# Altium schematic sheet Public_CPU_Power.SchDoc
size D
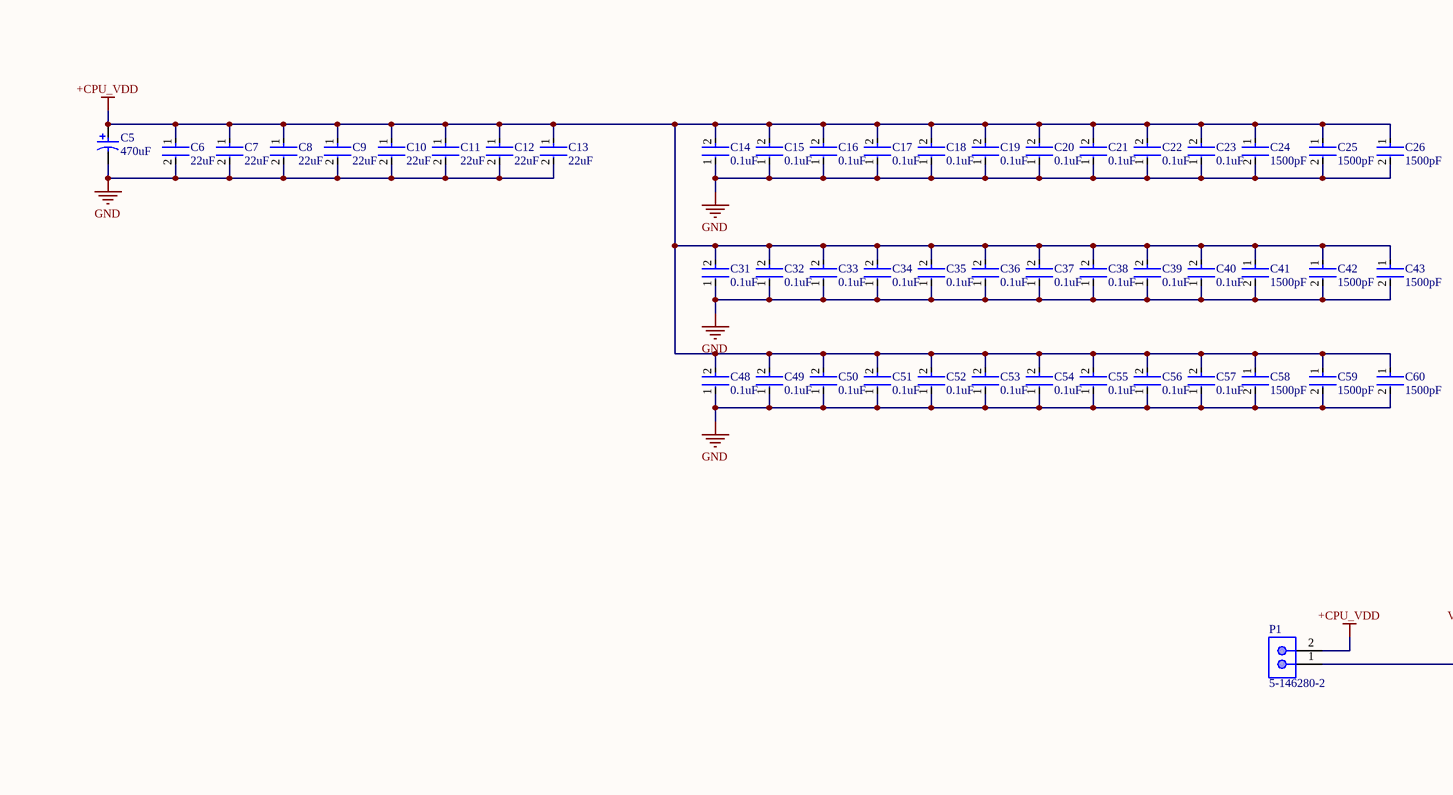
[diagram p0: Public_CPU_Power.SchDoc, top left]
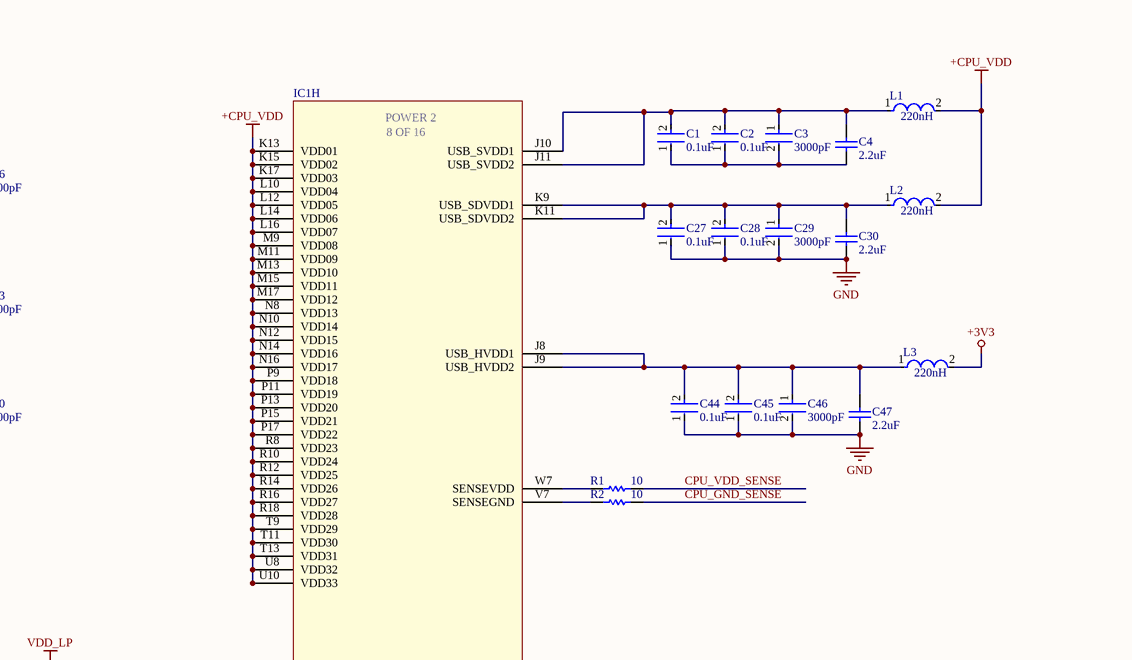
[diagram p1: Public_CPU_Power.SchDoc, top right]
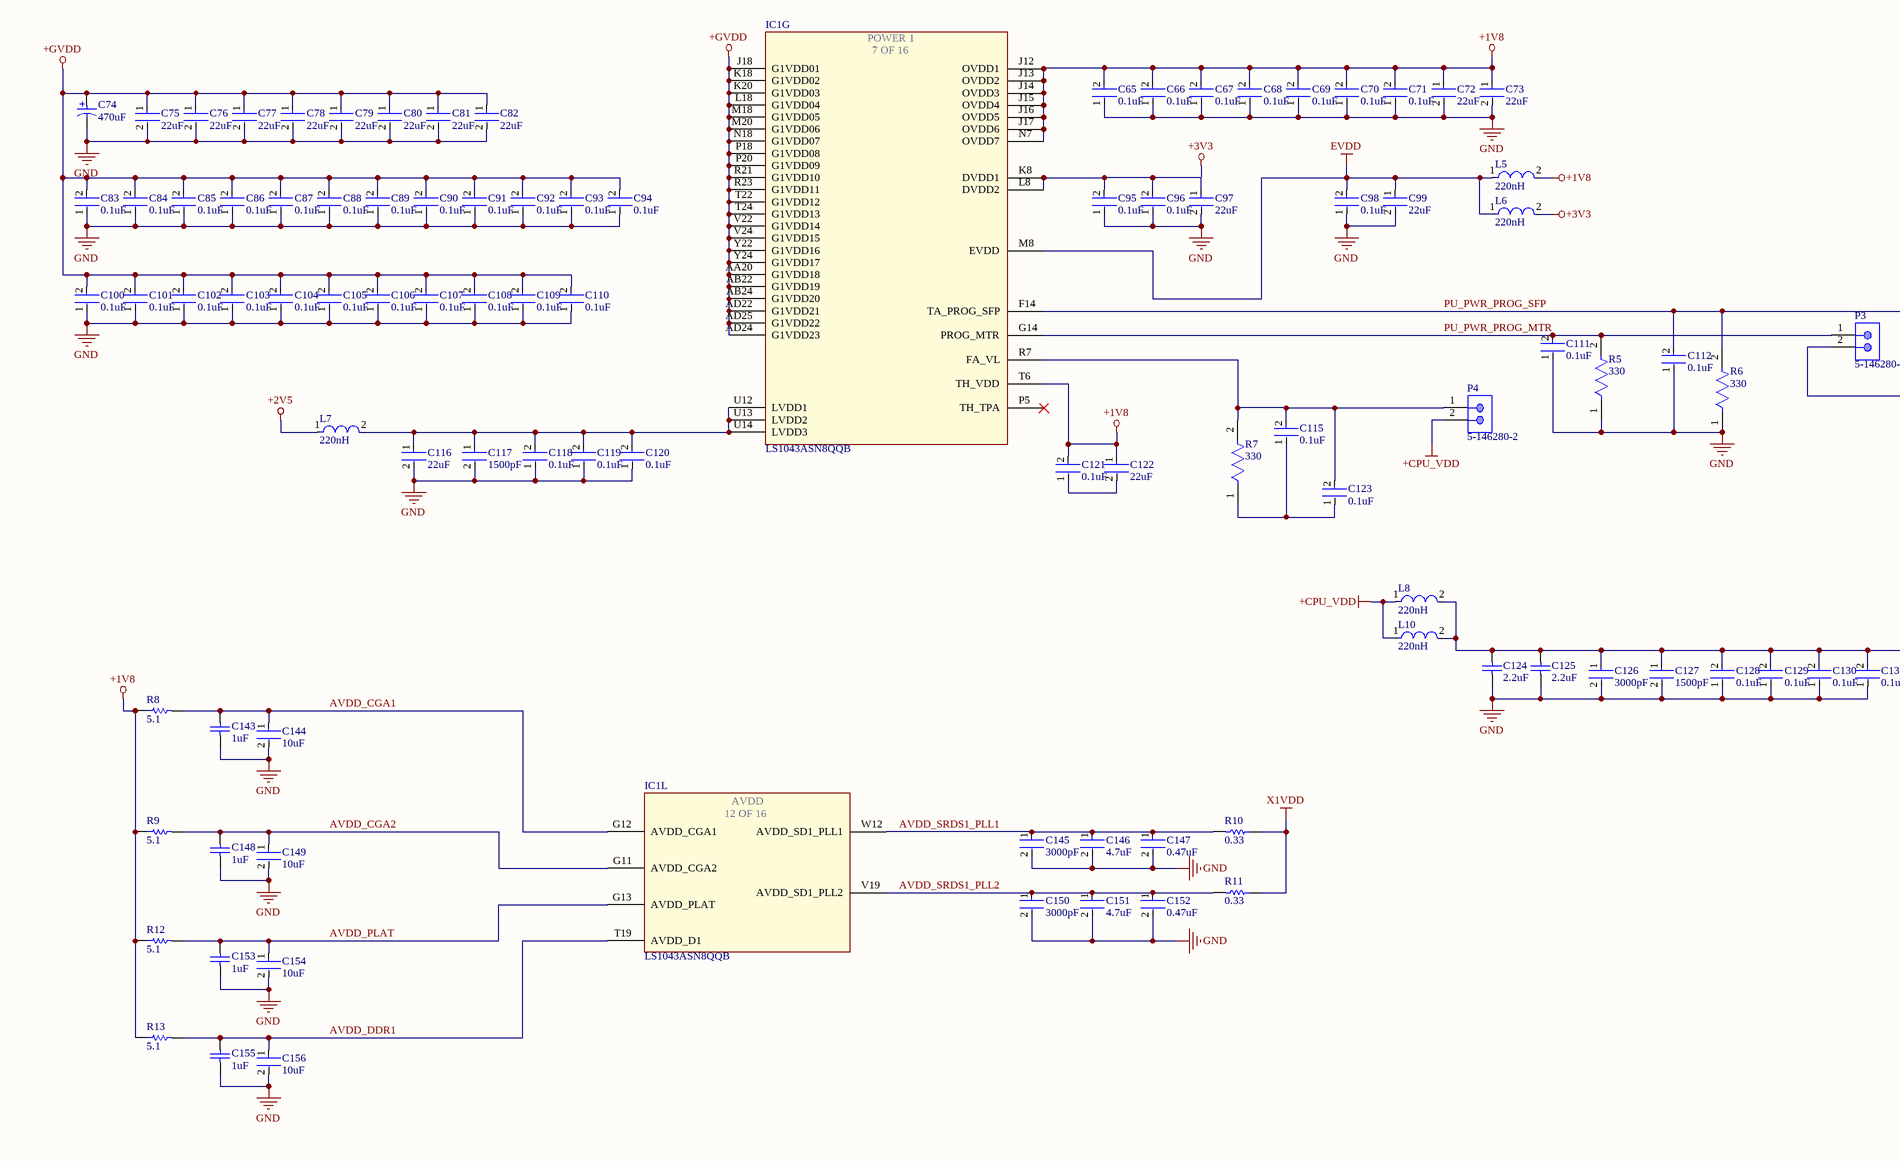
[diagram p2: Public_CPU_Power.SchDoc, bottom left]
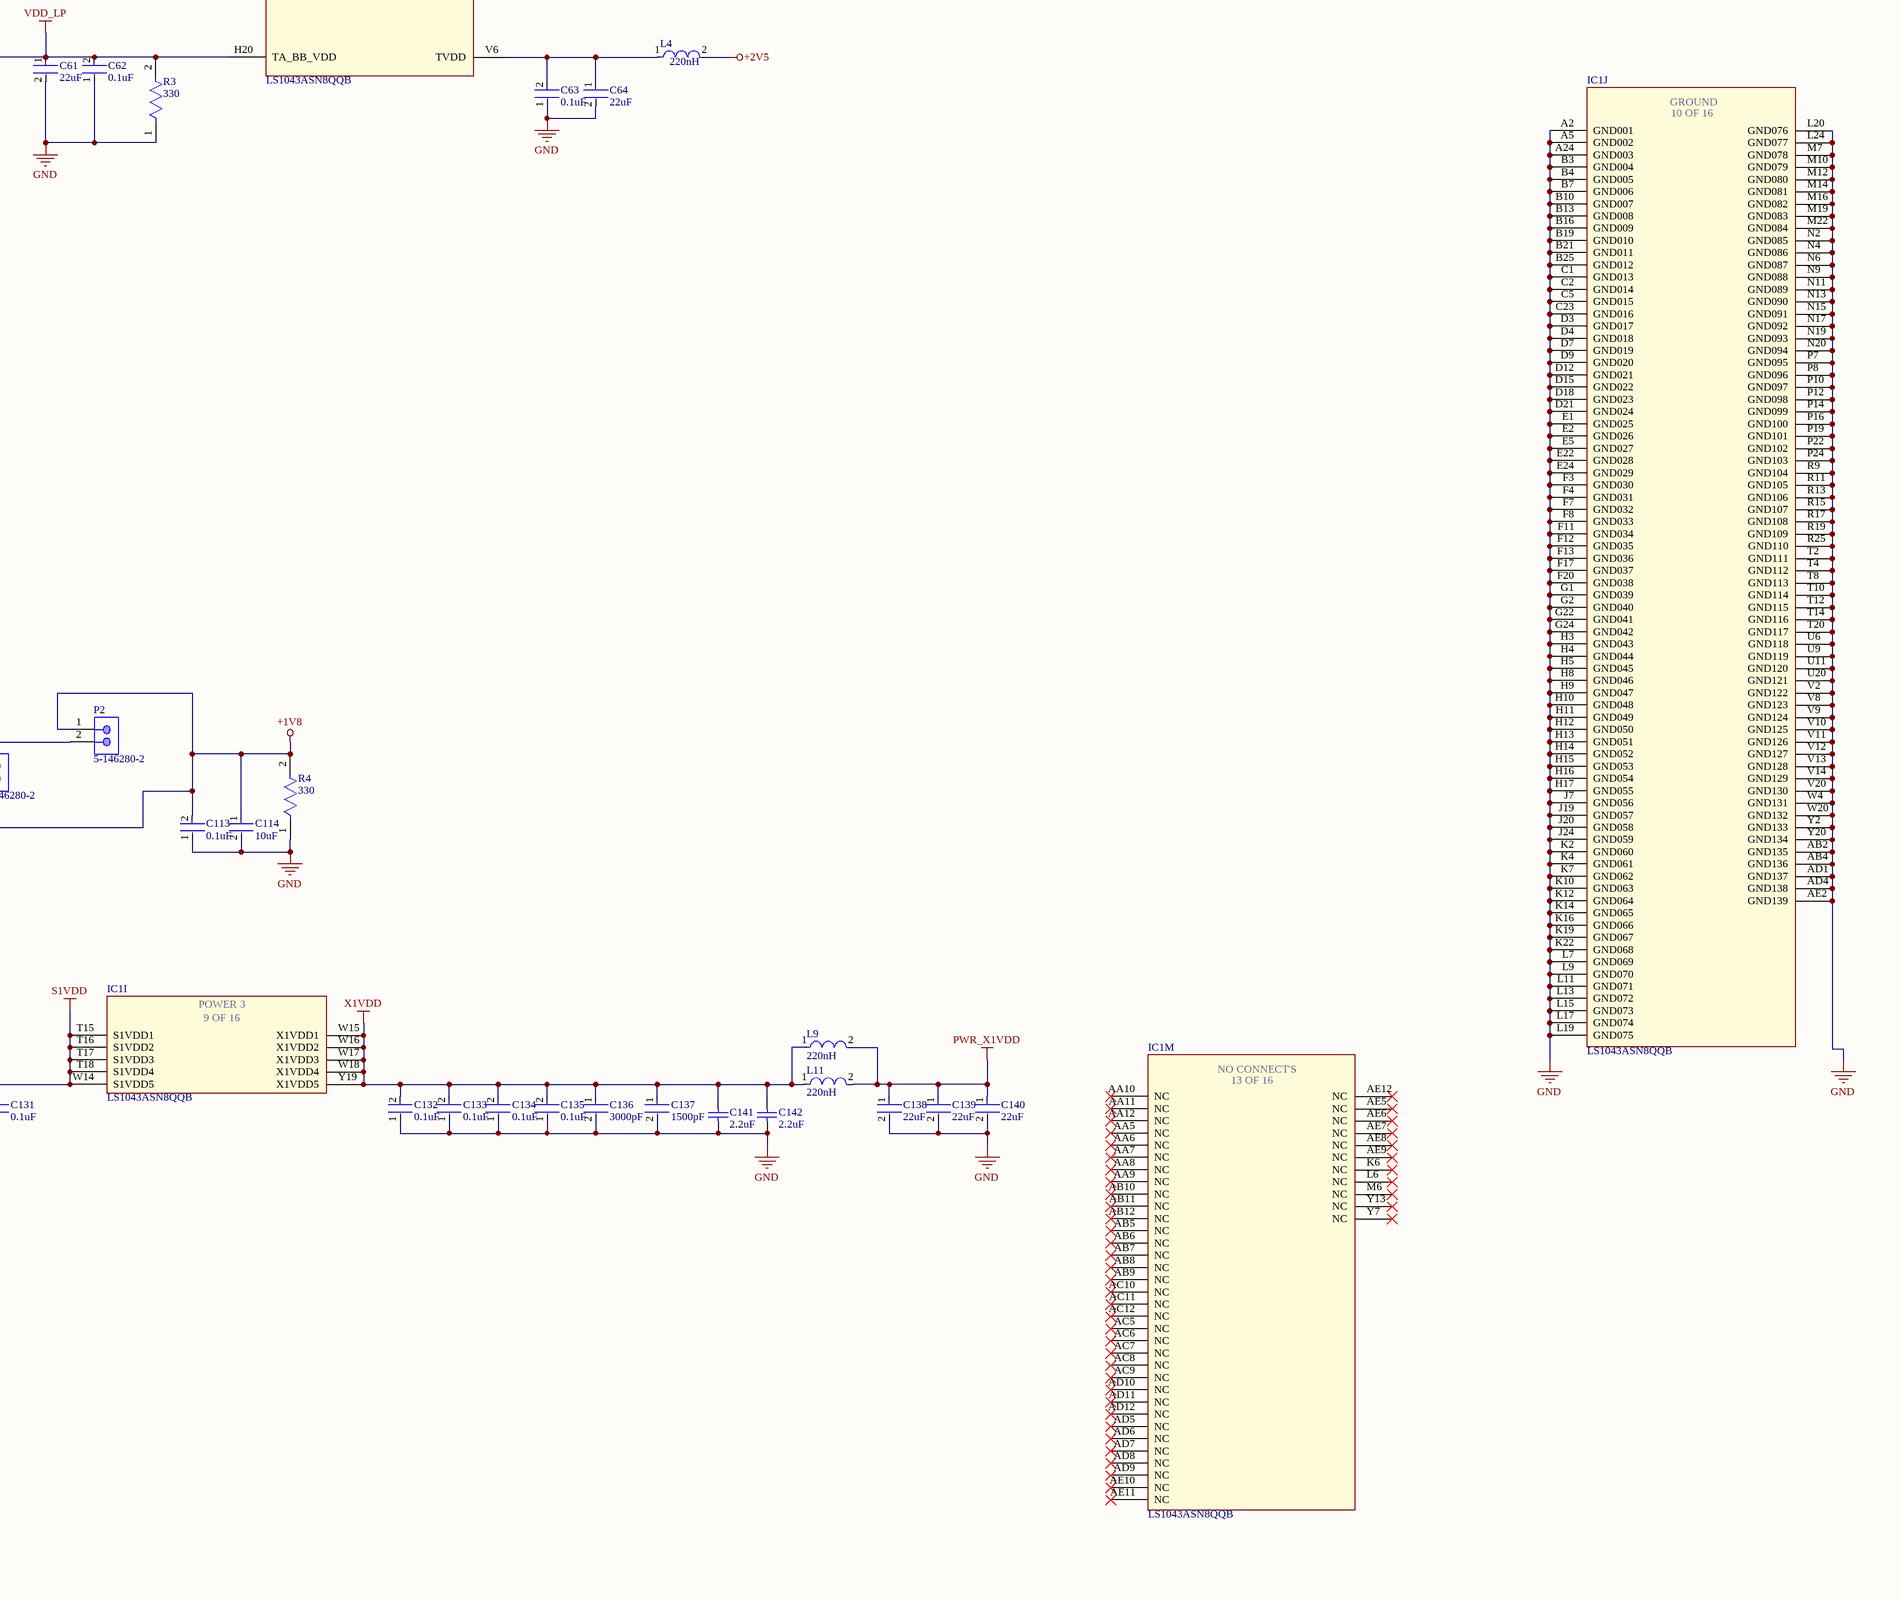
[diagram p3: Public_CPU_Power.SchDoc, bottom right]

## Parts
C1  0.1uF  [FP-GRM15-MFG]
C2  0.1uF  [FP-GRM15-MFG]
C3  3000pF  [FP-GRM155-0_05-IPC_B]
C4  2.2uF  [CAPC1005X55X30NL05T10]
C5  470uF  [PNSC-FK-V-F_V]
C6  22uF  [FP-GRM21B-0_15-MFG]
C7  22uF  [FP-GRM21B-0_15-MFG]
C8  22uF  [FP-GRM21B-0_15-MFG]
C9  22uF  [FP-GRM21B-0_15-MFG]
C10  22uF  [FP-GRM21B-0_15-MFG]
C11  22uF  [FP-GRM21B-0_15-MFG]
C12  22uF  [FP-GRM21B-0_15-MFG]
C13  22uF  [FP-GRM21B-0_15-MFG]
C14  0.1uF  [FP-GRM15-MFG]
C15  0.1uF  [FP-GRM15-MFG]
C16  0.1uF  [FP-GRM15-MFG]
C17  0.1uF  [FP-GRM15-MFG]
C18  0.1uF  [FP-GRM15-MFG]
C19  0.1uF  [FP-GRM15-MFG]
C20  0.1uF  [FP-GRM15-MFG]
C21  0.1uF  [FP-GRM15-MFG]
C22  0.1uF  [FP-GRM15-MFG]
C23  0.1uF  [FP-GRM15-MFG]
C24  1500pF  [FP-C0402-BB-MFG]
C25  1500pF  [FP-C0402-BB-MFG]
C26  1500pF  [FP-C0402-BB-MFG]
C27  0.1uF  [FP-GRM15-MFG]
C28  0.1uF  [FP-GRM15-MFG]
C29  3000pF  [FP-GRM155-0_05-IPC_B]
C30  2.2uF  [CAPC1005X55X30NL05T10]
C31  0.1uF  [FP-GRM15-MFG]
C32  0.1uF  [FP-GRM15-MFG]
C33  0.1uF  [FP-GRM15-MFG]
C34  0.1uF  [FP-GRM15-MFG]
C35  0.1uF  [FP-GRM15-MFG]
C36  0.1uF  [FP-GRM15-MFG]
C37  0.1uF  [FP-GRM15-MFG]
C38  0.1uF  [FP-GRM15-MFG]
C39  0.1uF  [FP-GRM15-MFG]
C40  0.1uF  [FP-GRM15-MFG]
C41  1500pF  [FP-C0402-BB-MFG]
C42  1500pF  [FP-C0402-BB-MFG]
C43  1500pF  [FP-C0402-BB-MFG]
C44  0.1uF  [FP-GRM15-MFG]
C45  0.1uF  [FP-GRM15-MFG]
C46  3000pF  [FP-GRM155-0_05-IPC_B]
C47  2.2uF  [CAPC1005X55X30NL05T10]
C48  0.1uF  [FP-GRM15-MFG]
C49  0.1uF  [FP-GRM15-MFG]
C50  0.1uF  [FP-GRM15-MFG]
C51  0.1uF  [FP-GRM15-MFG]
C52  0.1uF  [FP-GRM15-MFG]
C53  0.1uF  [FP-GRM15-MFG]
C54  0.1uF  [FP-GRM15-MFG]
C55  0.1uF  [FP-GRM15-MFG]
C56  0.1uF  [FP-GRM15-MFG]
C57  0.1uF  [FP-GRM15-MFG]
C58  1500pF  [FP-C0402-BB-MFG]
C59  1500pF  [FP-C0402-BB-MFG]
C60  1500pF  [FP-C0402-BB-MFG]
C61  22uF  [FP-GRM21B-0_15-MFG]
C62  0.1uF  [FP-GRM15-MFG]
C63  0.1uF  [FP-GRM15-MFG]
C64  22uF  [FP-GRM21B-0_15-MFG]
C65  0.1uF  [FP-GRM15-MFG]
C66  0.1uF  [FP-GRM15-MFG]
C67  0.1uF  [FP-GRM15-MFG]
C68  0.1uF  [FP-GRM15-MFG]
C69  0.1uF  [FP-GRM15-MFG]
C70  0.1uF  [FP-GRM15-MFG]
C71  0.1uF  [FP-GRM15-MFG]
C72  22uF  [FP-GRM21B-0_15-MFG]
C73  22uF  [FP-GRM21B-0_15-MFG]
C74  470uF  [PNSC-FK-V-F_V]
C75  22uF  [FP-GRM21B-0_15-MFG]
C76  22uF  [FP-GRM21B-0_15-MFG]
C77  22uF  [FP-GRM21B-0_15-MFG]
C78  22uF  [FP-GRM21B-0_15-MFG]
C79  22uF  [FP-GRM21B-0_15-MFG]
C80  22uF  [FP-GRM21B-0_15-MFG]
C81  22uF  [FP-GRM21B-0_15-MFG]
C82  22uF  [FP-GRM21B-0_15-MFG]
C83  0.1uF  [FP-GRM15-MFG]
C84  0.1uF  [FP-GRM15-MFG]
C85  0.1uF  [FP-GRM15-MFG]
C86  0.1uF  [FP-GRM15-MFG]
C87  0.1uF  [FP-GRM15-MFG]
C88  0.1uF  [FP-GRM15-MFG]
C89  0.1uF  [FP-GRM15-MFG]
C90  0.1uF  [FP-GRM15-MFG]
C91  0.1uF  [FP-GRM15-MFG]
C92  0.1uF  [FP-GRM15-MFG]
C93  0.1uF  [FP-GRM15-MFG]
C94  0.1uF  [FP-GRM15-MFG]
C95  0.1uF  [FP-GRM15-MFG]
C96  0.1uF  [FP-GRM15-MFG]
C97  22uF  [FP-GRM21B-0_15-MFG]
C98  0.1uF  [FP-GRM15-MFG]
C99  22uF  [FP-GRM21B-0_15-MFG]
C100  0.1uF  [FP-GRM15-MFG]
C101  0.1uF  [FP-GRM15-MFG]
C102  0.1uF  [FP-GRM15-MFG]
C103  0.1uF  [FP-GRM15-MFG]
C104  0.1uF  [FP-GRM15-MFG]
C105  0.1uF  [FP-GRM15-MFG]
C106  0.1uF  [FP-GRM15-MFG]
C107  0.1uF  [FP-GRM15-MFG]
C108  0.1uF  [FP-GRM15-MFG]
C109  0.1uF  [FP-GRM15-MFG]
C110  0.1uF  [FP-GRM15-MFG]
C111  0.1uF  [FP-GRM15-MFG]
C112  0.1uF  [FP-GRM15-MFG]
C113  0.1uF  [FP-GRM15-MFG]
C114  10uF  [FP-C0805C-DG-MFG]
C115  0.1uF  [FP-GRM15-MFG]
C116  22uF  [FP-GRM21B-0_15-MFG]
C117  1500pF  [FP-C0402-BB-MFG]
C118  0.1uF  [FP-GRM15-MFG]
C119  0.1uF  [FP-GRM15-MFG]
C120  0.1uF  [FP-GRM15-MFG]
C121  0.1uF  [FP-GRM15-MFG]
C122  22uF  [FP-GRM21B-0_15-MFG]
C123  0.1uF  [FP-GRM15-MFG]
C124  2.2uF  [CAPC1005X55X30NL05T10]
C125  2.2uF  [CAPC1005X55X30NL05T10]
C126  3000pF  [FP-GRM155-0_05-IPC_B]
C127  1500pF  [FP-C0402-BB-MFG]
C128  0.1uF  [FP-GRM15-MFG]
C129  0.1uF  [FP-GRM15-MFG]
C130  0.1uF  [FP-GRM15-MFG]
C131  0.1uF  [FP-GRM15-MFG]
C132  0.1uF  [FP-GRM15-MFG]
C133  0.1uF  [FP-GRM15-MFG]
C134  0.1uF  [FP-GRM15-MFG]
C135  0.1uF  [FP-GRM15-MFG]
C136  3000pF  [FP-GRM155-0_05-IPC_B]
C137  1500pF  [FP-C0402-BB-MFG]
C138  22uF  [FP-GRM21B-0_15-MFG]
C139  22uF  [FP-GRM21B-0_15-MFG]
C140  22uF  [FP-GRM21B-0_15-MFG]
C141  2.2uF  [CAPC1005X55X30NL05T10]
C142  2.2uF  [CAPC1005X55X30NL05T10]
C143  1uF  [CAPC1005X60X30LL05T10]
C144  10uF  [FP-C0805C-DG-MFG]
C145  3000pF  [FP-GRM155-0_05-IPC_B]
C146  4.7uF  [FP-GRM188-0_2-IPC_C]
C147  0.47uF  [FP-GRM188-0_1-e0_2_0_5-IPC_B]
C148  1uF  [CAPC1005X60X30LL05T10]
C149  10uF  [FP-C0805C-DG-MFG]
C150  3000pF  [FP-GRM155-0_05-IPC_B]
C151  4.7uF  [FP-GRM188-0_2-IPC_C]
C152  0.47uF  [FP-GRM188-0_1-e0_2_0_5-IPC_B]
C153  1uF  [CAPC1005X60X30LL05T10]
C154  10uF  [FP-C0805C-DG-MFG]
C155  1uF  [CAPC1005X60X30LL05T10]
C156  10uF  [FP-C0805C-DG-MFG]
IC1  LS1043ASN8QQB  [BGA780C80P28X28_2300X2300X261]  (parts G,H,I,J,L,M of 16)
L1  220nH  [FP-MPLCG0530-MFG]
L2  220nH  [FP-MPLCG0530-MFG]
L3  220nH  [FP-MPLCG0530-MFG]
L4  220nH  [FP-MPLCG0530-MFG]
L5  220nH  [FP-MPLCG0530-MFG]
L6  220nH  [FP-MPLCG0530-MFG]
L7  220nH  [FP-MPLCG0530-MFG]
L8  220nH  [FP-MPLCG0530-MFG]
L9  220nH  [FP-MPLCG0530-MFG]
L10  220nH  [FP-MPLCG0530-MFG]
L11  220nH  [FP-MPLCG0530-MFG]
P1  5-146280-2  [TECO-5-146280-2_V]
P2  5-146280-2  [TECO-5-146280-2_V]
P3  5-146280-2  [TECO-5-146280-2_V]
P4  5-146280-2  [TECO-5-146280-2_V]
R1  10  [RESC1005X40X25NL05T05]
R2  10  [RESC1005X40X25NL05T05]
R3  330  [FP-CRCW0402-e3-IPC_B]
R4  330  [FP-CRCW0402-e3-MFG]
R5  330  [FP-CRCW0402-e3-MFG]
R6  330  [FP-CRCW0402-e3-MFG]
R7  330  [FP-CRCW0402-e3-MFG]
R8  5.1  [RESC1005X40X25LL05T05]
R9  5.1  [RESC1005X40X25LL05T05]
R10  0.33  [RESC2013X50X40LL20T20]
R11  0.33  [RESC2013X50X40LL20T20]
R12  5.1  [RESC1005X40X25LL05T05]
R13  5.1  [RESC1005X40X25LL05T05]

## Nets
+1V8: C65.2 C66.2 C67.2 C68.2 C69.2 C70.2 C71.2 C72.1 C73.1 C113.2 C114.1 C121.2 C122.1 IC1.J12(OVDD1) IC1.J13(OVDD2) IC1.J14(OVDD3) IC1.J15(OVDD4) IC1.J16(OVDD5) IC1.J17(OVDD6) IC1.N7(OVDD7) IC1.T6(TH_VDD) L5.2 P2.1 P3.2 R4.2 R8.1 R9.1 R12.1 R13.1
+2V5: L4.2 L7.1
+3V3: L3.2 L6.2
+CPU_VDD: C5.1 C6.1 C7.1 C8.1 C9.1 C10.1 C11.1 C12.1 C13.1 C14.2 C15.2 C16.2 C17.2 C18.2 C19.2 C20.2 C21.2 C22.2 C23.2 C24.1 C25.1 C26.1 C31.2 C32.2 C33.2 C34.2 C35.2 C36.2 C37.2 C38.2 C39.2 C40.2 C41.1 C42.1 C43.1 C48.2 C49.2 C50.2 C51.2 C52.2 C53.2 C54.2 C55.2 C56.2 C57.2 C58.1 C59.1 C60.1 IC1.K13(VDD01) IC1.K15(VDD02) IC1.K17(VDD03) IC1.L10(VDD04) IC1.L12(VDD05) IC1.L14(VDD06) IC1.L16(VDD07) IC1.M9(VDD08) IC1.M11(VDD09) IC1.M13(VDD10) IC1.M15(VDD11) IC1.M17(VDD12) IC1.N8(VDD13) IC1.N10(VDD14) IC1.N12(VDD15) IC1.N14(VDD16) IC1.N16(VDD17) IC1.P9(VDD18) IC1.P11(VDD19) IC1.P13(VDD20) IC1.P15(VDD21) IC1.P17(VDD22) IC1.R8(VDD23) IC1.R10(VDD24) IC1.R12(VDD25) IC1.R14(VDD26) IC1.R16(VDD27) IC1.R18(VDD28) IC1.T9(VDD29) IC1.T11(VDD30) IC1.T13(VDD31) IC1.U8(VDD32) IC1.U10(VDD33) L1.2 L2.2 L8.1 L10.1 P1.2 P4.2
+GVDD: C74.1 C75.1 C76.1 C77.1 C78.1 C79.1 C80.1 C81.1 C82.1 C83.2 C84.2 C85.2 C86.2 C87.2 C88.2 C89.2 C90.2 C91.2 C92.2 C93.2 C94.2 C100.2 C101.2 C102.2 C103.2 C104.2 C105.2 C106.2 C107.2 C108.2 C109.2 C110.2 IC1.AA20(G1VDD18) IC1.AB22(G1VDD19) IC1.AB24(G1VDD20) IC1.AD22(G1VDD21) IC1.AD24(G1VDD23) IC1.AD25(G1VDD22) IC1.J18(G1VDD01) IC1.K18(G1VDD02) IC1.K20(G1VDD03) IC1.L18(G1VDD04) IC1.M18(G1VDD05) IC1.M20(G1VDD06) IC1.N18(G1VDD07) IC1.P18(G1VDD08) IC1.P20(G1VDD09) IC1.R21(G1VDD10) IC1.R23(G1VDD11) IC1.T22(G1VDD12) IC1.T24(G1VDD13) IC1.V22(G1VDD14) IC1.V24(G1VDD15) IC1.Y22(G1VDD16) IC1.Y24(G1VDD17)
EVDD: C98.2 C99.1 IC1.M8(EVDD) L5.1 L6.1
GND: C5.2 C6.2 C7.2 C8.2 C9.2 C10.2 C11.2 C12.2 C13.2 C14.1 C15.1 C16.1 C17.1 C18.1 C19.1 C20.1 C21.1 C22.1 C23.1 C24.2 C25.2 C26.2 C27.1 C28.1 C29.2 C30.1 C31.1 C32.1 C33.1 C34.1 C35.1 C36.1 C37.1 C38.1 C39.1 C40.1 C41.2 C42.2 C43.2 C44.1 C45.1 C46.2 C47.1 C48.1 C49.1 C50.1 C51.1 C52.1 C53.1 C54.1 C55.1 C56.1 C57.1 C58.2 C59.2 C60.2 C61.2 C62.1 C63.1 C64.2 C65.1 C66.1 C67.1 C68.1 C69.1 C70.1 C71.1 C72.2 C73.2 C74.2 C75.2 C76.2 C77.2 C78.2 C79.2 C80.2 C81.2 C82.2 C83.1 C84.1 C85.1 C86.1 C87.1 C88.1 C89.1 C90.1 C91.1 C92.1 C93.1 C94.1 C95.1 C96.1 C97.2 C98.1 C99.2 C100.1 C101.1 C102.1 C103.1 C104.1 C105.1 C106.1 C107.1 C108.1 C109.1 C110.1 C111.1 C112.1 C113.1 C114.2 C116.2 C117.2 C118.1 C119.1 C120.1 C124.1 C125.1 C126.2 C127.2 C128.1 C129.1 C130.1 C131.1 C132.1 C133.1 C134.1 C135.1 C136.2 C137.2 C138.2 C139.2 C140.2 C141.1 C142.1 C143.1 C144.2 C145.2 C146.2 C147.2 C148.1 C149.2 C150.2 C151.2 C152.2 C153.1 C154.2 C155.1 C156.2 IC1.A2(GND001) IC1.A5(GND002) IC1.A24(GND003) IC1.AB2(GND135) IC1.AB4(GND136) IC1.AD1(GND137) IC1.AD4(GND138) IC1.AE2(GND139) IC1.B3(GND004) IC1.B4(GND005) IC1.B7(GND006) IC1.B10(GND007) IC1.B13(GND008) IC1.B16(GND009) IC1.B19(GND010) IC1.B21(GND011) IC1.B25(GND012) IC1.C1(GND013) IC1.C2(GND014) IC1.C5(GND015) IC1.C23(GND016) IC1.D3(GND017) IC1.D4(GND018) IC1.D7(GND019) IC1.D9(GND020) IC1.D12(GND021) IC1.D15(GND022) IC1.D18(GND023) IC1.D21(GND024) IC1.E1(GND025) IC1.E2(GND026) IC1.E5(GND027) IC1.E22(GND028) IC1.E24(GND029) IC1.F3(GND030) IC1.F4(GND031) IC1.F7(GND032) IC1.F8(GND033) IC1.F11(GND034) IC1.F12(GND035) IC1.F13(GND036) IC1.F17(GND037) IC1.F20(GND038) IC1.G1(GND039) IC1.G2(GND040) IC1.G22(GND041) IC1.G24(GND042) IC1.H3(GND043) IC1.H4(GND044) IC1.H5(GND045) IC1.H8(GND046) IC1.H9(GND047) IC1.H10(GND048) IC1.H11(GND049) IC1.H12(GND050) IC1.H13(GND051) IC1.H14(GND052) IC1.H15(GND053) IC1.H16(GND054) IC1.H17(GND055) IC1.J7(GND056) IC1.J19(GND057) IC1.J20(GND058) IC1.J24(GND059) IC1.K2(GND060) IC1.K4(GND061) IC1.K7(GND062) IC1.K10(GND063) IC1.K12(GND064) IC1.K14(GND065) IC1.K16(GND066) IC1.K19(GND067) IC1.K22(GND068) IC1.L7(GND069) IC1.L9(GND070) IC1.L11(GND071) IC1.L13(GND072) IC1.L15(GND073) IC1.L17(GND074) IC1.L19(GND075) IC1.L20(GND076) IC1.L24(GND077) IC1.M7(GND078) IC1.M10(GND079) IC1.M12(GND080) IC1.M14(GND081) IC1.M16(GND082) IC1.M19(GND083) IC1.M22(GND084) IC1.N2(GND085) IC1.N4(GND086) IC1.N6(GND087) IC1.N9(GND088) IC1.N11(GND089) IC1.N13(GND090) IC1.N15(GND091) IC1.N17(GND092) IC1.N19(GND093) IC1.N20(GND094) IC1.P7(GND095) IC1.P8(GND096) IC1.P10(GND097) IC1.P12(GND098) IC1.P14(GND099) IC1.P16(GND100) IC1.P19(GND101) IC1.P22(GND102) IC1.P24(GND103) IC1.R9(GND104) IC1.R11(GND105) IC1.R13(GND106) IC1.R15(GND107) IC1.R17(GND108) IC1.R19(GND109) IC1.R25(GND110) IC1.T2(GND111) IC1.T4(GND112) IC1.T8(GND113) IC1.T10(GND114) IC1.T12(GND115) IC1.T14(GND116) IC1.T20(GND117) IC1.U6(GND118) IC1.U9(GND119) IC1.U11(GND120) IC1.U20(GND121) IC1.V2(GND122) IC1.V8(GND123) IC1.V9(GND124) IC1.V10(GND125) IC1.V11(GND126) IC1.V12(GND127) IC1.V13(GND128) IC1.V14(GND129) IC1.V20(GND130) IC1.W4(GND131) IC1.W20(GND132) IC1.Y2(GND133) IC1.Y20(GND134) R3.1 R4.1 R5.1 R6.1
PWR_X1VDD: C138.1 C139.1 C140.1 L9.2 L11.2
S1VDD: C124.2 C125.2 C126.1 C127.1 C128.2 C129.2 C130.2 C131.2 IC1.T15(S1VDD1) IC1.T16(S1VDD2) IC1.T17(S1VDD3) IC1.T18(S1VDD4) IC1.W14(S1VDD5) L8.2 L10.2
VDD_LP: C61.1 C62.2 IC1.H20(TA_BB_VDD) P1.1 R3.2
X1VDD: C132.2 C133.2 C134.2 C135.2 C136.1 C137.1 C141.2 C142.2 IC1.W15(X1VDD1) IC1.W16(X1VDD2) IC1.W17(X1VDD3) IC1.W18(X1VDD4) IC1.Y19(X1VDD5) L9.1 L11.1 R10.1 R11.1
AVDD_CGA1: C143.2 C144.1 IC1.G12(AVDD_CGA1) R8.2
AVDD_CGA2: C148.2 C149.1 IC1.G11(AVDD_CGA2) R9.2
AVDD_DDR1: C155.2 C156.1 IC1.T19(AVDD_D1) R13.2
AVDD_PLAT: C153.2 C154.1 IC1.G13(AVDD_PLAT) R12.2
AVDD_SRDS1_PLL1: C145.1 C146.1 C147.1 IC1.W12(AVDD_SD1_PLL1) R10.2
AVDD_SRDS1_PLL2: C150.1 C151.1 C152.1 IC1.V19(AVDD_SD1_PLL2) R11.2
CPU_GND_SENSE: R2.2
CPU_VDD_SENSE: R1.2
PU_PWR_PROG_MTR: C111.2 IC1.G14(PROG_MTR) P3.1 R5.2
PU_PWR_PROG_SFP: C112.2 IC1.F14(TA_PROG_SFP) P2.2 R6.2
NetC1_1: C1.1 C2.1 C3.2 C4.1
NetC1_2: C1.2 C2.2 C3.1 C4.2 IC1.J10(USB_SVDD1) IC1.J11(USB_SVDD2) L1.1
NetC27_2: C27.2 C28.2 C29.1 C30.2 IC1.K9(USB_SDVDD1) IC1.K11(USB_SDVDD2) L2.1
NetC44_2: C44.2 C45.2 C46.1 C47.2 IC1.J8(USB_HVDD1) IC1.J9(USB_HVDD2) L3.1
NetC63_2: C63.2 C64.1 IC1.V6(TVDD) L4.1
NetC95_2: C95.2 C96.2 C97.1 IC1.K8(DVDD1) IC1.L8(DVDD2)
NetC115_1: C115.1 C123.1 R7.1
NetC115_2: C115.2 C123.2 IC1.R7(FA_VL) P4.1 R7.2
NetC116_1: C116.1 C117.1 C118.2 C119.2 C120.2 IC1.U12(LVDD1) IC1.U13(LVDD2) IC1.U14(LVDD3) L7.2
NetC121_1: C121.1 C122.2
NetIC1_V7: IC1.V7(SENSEGND) R2.1
NetIC1_W7: IC1.W7(SENSEVDD) R1.1

Not connected (* = marked no-connect by the designer): IC1 AA5(NC)* AA6(NC)* AA7(NC)* AA8(NC)* AA9(NC)* AA10(NC)* AA11(NC)* AA12(NC)* AB5(NC)* AB6(NC)* AB7(NC)* AB8(NC)* AB9(NC)* AB10(NC)* AB11(NC)* AB12(NC)* AC5(NC)* AC6(NC)* AC7(NC)* AC8(NC)* AC9(NC)* AC10(NC)* AC11(NC)* AC12(NC)* AD5(NC)* AD6(NC)* AD7(NC)* AD8(NC)* AD9(NC)* AD10(NC)* AD11(NC)* AD12(NC)* AE5(NC)* AE6(NC)* AE7(NC)* AE8(NC)* AE9(NC)* AE10(NC)* AE11(NC)* AE12(NC)* K6(NC)* L6(NC)* M6(NC)* P5(TH_TPA)* Y7(NC)* Y13(NC)*

## Notes on the sheet
- Title
- Size:
- Date:
- File:
- D
- Number:
- Time:
- Revision:
- Sheet
- of
- (in symbol LS1043ASN8QQB, part G) POWER 1; 7 OF 16
- (in symbol LS1043ASN8QQB, part H) POWER 2; 8 OF 16
- (in symbol LS1043ASN8QQB, part I) POWER 3; 9 OF 16
- (in symbol LS1043ASN8QQB, part J) GROUND; 10 OF 16
- (in symbol LS1043ASN8QQB, part L) AVDD; 12 OF 16
- (in symbol LS1043ASN8QQB, part M) NO CONNECT'S; 13 OF 16

## Library data of the parts
C1 C2 C14-C23 C27 C28 C31-C40 C44 C45 C48-C57 C62 C63 C65-C71 C83-C96 C98 C100-C113 C115 C118-C121 C123 C128-C135 = CMP-2100-03641-2: CAP CER 0.1UF 16V X7R 0402; Manufacturer Part Number: GRM155R71C104KA88D; Manufacturer: Murata; Standoff Height: 0mm; Tolerance: 10%; Voltage Rating: 16Vdc; Material: Ceramic; Capacitance: 0.10μF; Value: 0.10μF; RoHS: TRUE; Temperature Characteristic: X7R; Octopart: https://octopart.com/grm155r71c104ka88d-murata-196880; Digikey Description: CAP CER 0.1UF 16V X7R 0402; Device Class L3: Ceramic Capacitors; Height: 0.55mm; ComponentLink2Description: Datasheet; Temperature Range Low: -55°C; Ipc Land Pattern Name: CAPC10050X219; ComponentLink2URL: https://search.murata.co.jp/Ceramy/image/img/A01X/G101/ENG/GRM155R71H471KA01-01A.pdf; Device Class L1: Passive Components; Lead Free: yes; Category: Cap; Package: GRM15; Temperature: -55°C to +125°C; Device Class L2: Capacitors; Temperature Range High: +125°C; Mouser Description: 0402 0.1 uF 16V ±10 % Tolerance X7R SMT Multilayer Ceramic Capacitor
C3 C29 C46 C126 C136 C145 C150 = CMP-2008-04488-2: Chip Multilayer Ceramic Capacitors for General Purpose, 0402, 3000pF, U2J, -750ppm/°C, 5%, 10V; Capacitance: 3nF; Termination: SMD/SMT; Case Code (Imperial): 0402; Radiation Hardening: No; Mount: Surface Mount; Tolerance: 5%; Packaging: Tape and Reel; Thickness: 0.022inch; Max Operating Temperature: 125°C; Length: 1mm; Min Operating Temperature: -55°C; Voltage Rating (DC): 10V; Dielectric: U2J; Depth: 0.5mm; Lead Free: Lead Free; Width: 0.5mm; Package Quantity: 10000; Height: 0.5mm; Case Code (Metric): 1005; Voltage Rating: 10V; Case/Package: 0402
C4 C30 C47 C124 C125 C141 C142 = CMP-2008-02064-2: Manufacturer: Kemet; Part Number: C0402C225M9PACTU
C5 C74 = CMP-2000-06204-1: Aluminum Electrolytic Capacitor, 470 uF, +/- 20%, 16 V, 2-Pin SMD (Size Code F), -55 to 105 degC, RoHS, Tape and Reel; Manufacturer: Panasonic; Capacitance: 470µF; Type: Can; Ripple Current: 600mA; Lifetime@Temperature: 2000Hrs@105°C; Impedance: 0.16O; Rated Voltage: 16V; Manufacturer URL: http://www.panasonic.com/; Package Description: 2-Pin Electrolytic Aluminum Capacitor, Body 8.3 x 8.3 mm; Operating Temp-Max: 105°C; Mounting Technology: SurfaceMount; Operating Temp Range: -55to+105°C; Datasheet Version: 03/2016; Series: FK; Package Reference: FK-V-F; Case Size/Dimension: Ø8x10.2mm; Package URL: http://industrial.panasonic.com/cdbs/www-data/pdf/RDE0000/DME0000COL48.pdf; Datasheet URL: http://industrial.panasonic.com/cdbs/www-data/pdf/RDE0000/ABA0000C1181.pdf
C6-C13 C61 C64 C72 C73 C75-C82 C97 C99 C116 C122 C138-C140 = CMP-2007-03385-2: Chip Multilayer Ceramic Capacitors for General Purpose, 0805, 22uF, X5R, 15%, 20%, 6.3V; Material: Ceramic; Max Operating Temperature: 85°C; Voltage: 6.3V; Min Operating Temperature: -55°C; Case/Package: 0805; Thickness: 0.053inch; Dielectric: X5R; Packaging: Tape and Reel; Depth: 1.25mm; Termination: SMD/SMT; Voltage Rating (DC): 6.3V; Radiation Hardening: No; Tolerance: 20%; Mount: Surface Mount; Lead Free: Lead Free; Package Quantity: 1; REACH SVHC: No SVHC; Voltage Rating: 6.3V; Capacitance: 22uF; Length: 2mm; Case Code (Imperial): 0805; Case Code (Metric): 2012; Width: 0.049inch; Height: 1.25mm
C24-C26 C41-C43 C58-C60 C117 C127 C137 = CMP-2008-03108-2: CAP CER 1500PF 50V X7R 0402; Manufacturer Part Number: C0402C152K5RACTU; Manufacturer: Kemet; Value: 1,500 pF; Material: Ceramic; Tolerance: 0.1; Temperature Coefficient: 15%; Automotive: No; Octopart: https://octopart.com/c0402c152k5ractu-kemet-125298; Device Class L3: Ceramic Capacitors; Device Class L2: Capacitors; Mouser Description: Multilayer Ceramic Capacitors MLCC - SMD/SMT 50volts 1500pF X7R 10%; Temperature Range High: +125°C; ComponentLink2URL: https://content.kemet.com/datasheets/KEM_C1002_X7R_SMD.pdf; ComponentLink2Description: Datasheet; RoHS: TRUE; Temperature: -55°C to +125°C; Height: 0.55mm; Device Class L1: Passive Components; Voltage Rating: 50 V; Lead Free: Yes; Temperature Characteristic: X7R; Temperature Range Low: -55°C; Capacitance: 1,500 pF; Package: C0402-BB; Category: Cap; Digikey Description: CAP CER 1500PF 50V X7R 0402; Ipc Land Pattern Name: CAPC10050X50
C114 C144 C149 C154 C156 = CMP-2007-03243-2: CAP CER 10UF 10V X5R 0805; Manufacturer Part Number: C0805C106K8PACTU; Manufacturer: Kemet; 3DS Part Number: 220-00001; Tolerance: 10%; Temperature Coefficient: 15%; Material: Ceramic; Device Class L2: Capacitors; Device Class L1: Passive Components; ComponentLink2URL: https://content.kemet.com/datasheets/KEM_C1006_X5R_SMD.pdf; Height: 1.4mm; Lead Free: Yes; Digikey Description: CAP CER 10UF 10V X5R 0805; Octopart: https://octopart.com/c0805c106k8pactu-kemet-98697; Capacitance: 10uF; Value: 10uF; Temperature Range Low: -55°C; Temperature: -55°C to +85°C; Automotive: No; Mouser Description: CAP CER 10UF 10V X5R 0805; Ipc Land Pattern Name: CAPC200125X125; Temperature Range High: +85°C; Voltage: 10V; RoHS: TRUE; Device Class L3: Ceramic Capacitors; ComponentLink2Description: Datasheet; Voltage Rating: 10V; Package: C0805C-DG; Temperature Characteristic: X5R; Category: Cap
C143 C148 C153 C155 = CMP-2008-02081-1: Part Number: C0402C105K8PAC7867; Manufacturer: Kemet
C146 C151 = CMP-2006-02545-2: Chip Multilayer Ceramic Capacitors for General Purpose, 0603, 4.7uF, X5R, 15%, 10%, 35V; Lead Free: Lead Free; Max Operating Temperature: 85°C; Case Code (Imperial): 0603; Capacitance: 4.7uF; Width: 0.8mm; Thickness: 0.031inch; Case Code (Metric): 1608; Min Operating Temperature: -55°C; Voltage Rating (DC): 35V; Dielectric: X5R; Voltage: 35V; Packaging: Tape and Reel; Resistor Type: Ceramic; Weight: 0.000222oz; Mount: Surface Mount; Material: Ceramic; Depth: 0.8mm; Tolerance: 10%; REACH SVHC: No SVHC; Case/Package: 0603; Voltage Rating: 35V; Package Quantity: 4000; Height: 0.8mm; Length: 1.6mm; Termination: SMD/SMT
C147 C152 = CMP-2006-02860-2: Chip Multilayer Ceramic Capacitors for General Purpose, 0603, 0.47uF, X7R, 15%, 10%, 16V; Capacitance: 470nF; Material: Ceramic; Termination: SMD/SMT; Case Code (Imperial): 0603; Height: 0.8mm; Dielectric: X7R; Length: 1.6mm; Packaging: Tape and Reel; Mount: Surface Mount; Thickness: 0.035inch; Voltage Rating (DC): 16V; Case Code (Metric): 1608; REACH SVHC: No SVHC; Depth: 0.8mm; Number of Pins: 2; Max Operating Temperature: 125°C; Min Operating Temperature: -55°C; Width: 0.8mm; Voltage: 16V; Lead Free: Lead Free; Voltage Rating: 16V; Package Quantity: 1; Case/Package: 0603; Tolerance: 10%
IC1 = LS1043ASN8QQB: Integrated Circuit; Manufacturer_Name: NXP; Datasheet Link: http://www.nxp.com/secured/assets/documents/en/data-sheet/LS1088A.pdf; Height: 2.61mm; Manufacturer_Part_Number: LS1043ASN8QQB; Mouser Part Number: 771-LS1043ASN8QQB; Mouser Price/Stock: https://www.mouser.co.uk/ProductDetail/NXP-Semiconductors/LS1043ASN8QQB/?qs=AQlKX63v8RsTATOTx7X0Jg%3D%3D
L1-L11 = CMP-03027-000001-1: FIXED IND 220NH 14.1A 3.7 MOHM; Manufacturer: KEMET; Manufacturer Part Number: MPLCG0530LR22; Shielding: true; Saturation Current: 10.2A; Series Resistance: 3.7mΩ; Value: 0.22uH; Standoff Height: 0.1mm; Core Material: Metal Composite; Tolerance: 20%; Test Frequency: 100kHz; Octopart: https://octopart.com/mplcg0530lr22-kemet-30531716; Composition: Wirewound; Height: 3mm; Device Class L2: Inductors; Rms Current: 14.1A; Digikey Description: FIXED IND 220NH 14.1A 3.7 MOHM; Package: MPLCG0530; ComponentLink2Description: Datasheet; Automotive: No; Inductance: 0.22uH; ComponentLink2URL: https://content.kemet.com/datasheets/KEM_L9005_MPLCG.pdf; Temperature Range High: +125°C; RoHS: TRUE; Device Class L3: Fixed Inductors; Temperature Range Low: -40°C; Category: Ind; Device Class L1: Passive Components; Lead Free: Yes; Mouser Description: Fixed Inductors 0.22uH 20% SMD; Temperature: -40°C to +125°C
P1-P4 = CMP-2000-07492-1: Male Header, Pitch 2.54 mm, 1 x 2 Position, Height 8.21 mm, Tail Length 3.05 mm, -65 to 105 degC, RoHS, Bulk; Manufacturer: TE Connectivity; Mating Connector Lock: No(Without); Number of Positions: 2; Pitch: 2.54mm; PCB Mounting Orientation: Vertical; Keyed: No; Case\/Package: 100; Mating Post Length: 0.23inch; High Temperature Housing: Yes; Max Current Rating: 5A; PCB Thickness: 0.063inch; PCB Mount Retention: Without; Approvals: CSA; Current Rating: 3A; Radiation Hardening: No; Length: 4.67mm; Contact Mating Length: 0.23inch; Connector Type: Header; Number of Rows: 1; Termination Post Length: 0.12inch; Board Standoff: No(Without); Max Operating Temperature: 105degC; Contact Shape: Square; Selectively Loaded: No(Without); Gasket: No(Without); Number of Contacts: 2; Contact Gender: Male; Mating Alignment: No(Without); Manufacturer URL: http://www.te.com/; Datasheet URL: http://www.te.com/commerce/DocumentDelivery/DDEController?Action=showdoc&DocId=Customer+Drawing%7F146280%7FH1%7Fpdf%7FEnglish%7FENG_CD_146280_H1.pdf%7F5-146280-2; Mount: ThroughHole; Orientation: Straight; Packaging: Carton; Package Reference: 5-146280-2; Package Quantity: 500; Stabilizers: No(Without); Row Spacing: 2.54mm; Contact Material: CopperAlloy; Panel Mount Retention: No(Without); Datasheet Version: Rev. H1, 08/2016; Housing Colour: Black; Colour: Black; Package Description: Male Header, Pitch 2.54 mm, 1 x 2 Position, Height 8.21 mm, Tail Length 3.05 mm; Contact Plating: Matte; Housing Material: Polymer; Contact Protection: No(Without); Min Operating Temperature: -65degC; Mounting Technology: ThroughHole; Flammability Rating: UL94V-0; RoHSCompliant: true; Termination: ThroughHole; Depth: 2.34mm; High Speed Serial Data Connector: No
R1 R2 = CMP-2002-08143-1: Part Number: CRCW040210R0FKED; Manufacturer: Vishay Dale
R3-R7 = CMP-2002-08523-2: RES Thick Film, 330Ω, 1%, 0.063W, 100ppm/°C, 0402; Max Power Dissipation: 63mW; Voltage Rating (DC): 50V; Resistance: 330R; Case/Package: 0402; Packaging: Tape and Reel; Width: 0.5mm; Case Code (Metric): 1005; Radiation Hardening: No; Military Standard: Not; Contact Plating: Tin; Temperature Coefficient: 100ppm/°C; Lead Free: Lead Free; Power Rating: 63mW; Voltage Rating: 50V; Tolerance: 1%; Features: Automotive AEC-Q200; Case Code (Imperial): 0402; Composition: Thick Film; Weight: 2.3E-05oz; Package Quantity: 10; Min Operating Temperature: -55°C; Height: 0.35mm; Length: 1mm; Termination: SMD/SMT; Number of Terminations: 2; Depth: 0.5mm; Max Operating Temperature: 155°C
R8 R9 R12 R13 = CMP-1011-00251-2: Part Number: CRCW04025R10FKED; Manufacturer: Vishay Dale
R10 R11 = CMP-2001-03204-1: Manufacturer: Susumu; Part Number: RP2012T-R33-F